# EasyEDA Pro project ProProject_7SegmentDisplay_2024-07-23.epro

# Schematic Breakout
Create Date: 2024-07-23; Page Name: P1; Project Name: 7SegmentDisplay; Schematic Name: Breakout; Update Date: 2024-07-23; Company: EasyEDA.com; Drawn: EasyEDA; Page Size: A4; Part Number: JLCPCB-002; Reviewed: EasyEDA; Version: V0.1
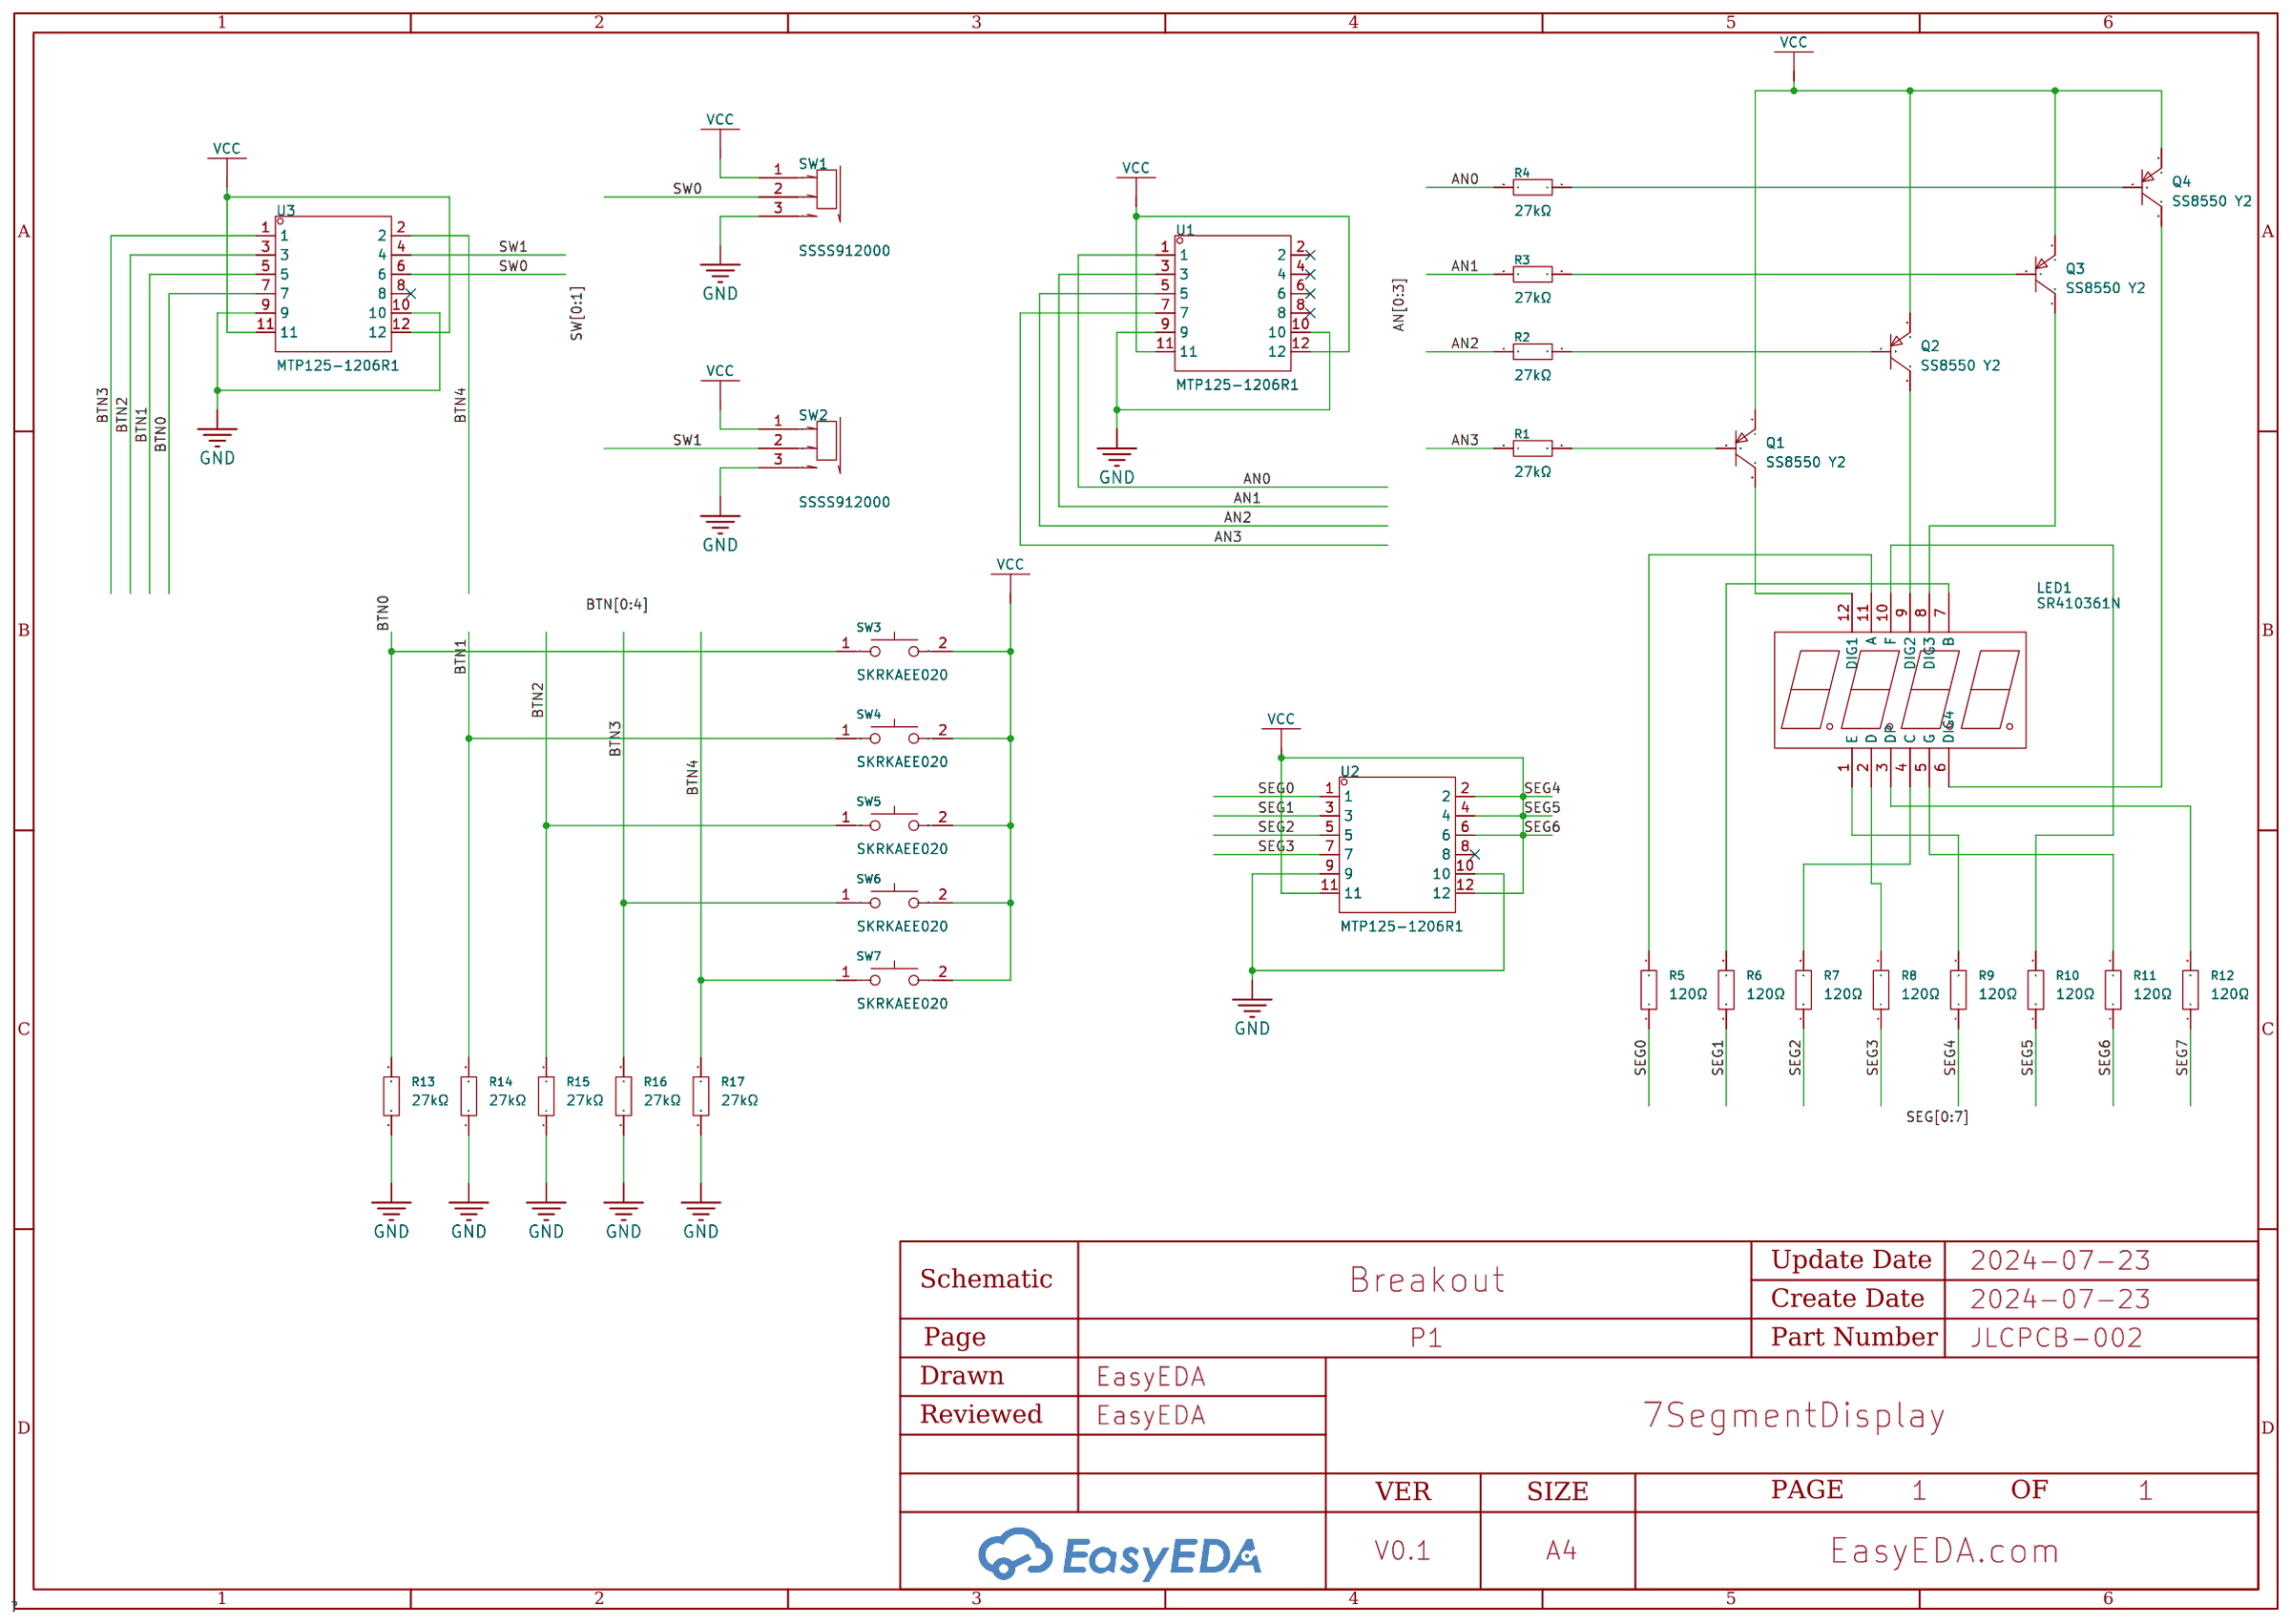
[diagram p0: schematic sheet]

## Parts
LED1  SR410361N  [LED-SEG-TH_12P-L30.0-W14.0-P2.54-S10.26-BL]
Q1  SS8550 Y2  [SOT-23-3_L2.9-W1.3-P1.90-LS2.4-BR]
Q2  SS8550 Y2  [SOT-23-3_L2.9-W1.3-P1.90-LS2.4-BR]
Q3  SS8550 Y2  [SOT-23-3_L2.9-W1.3-P1.90-LS2.4-BR]
Q4  SS8550 Y2  [SOT-23-3_L2.9-W1.3-P1.90-LS2.4-BR]
R1  27kΩ  [R0603]
R2  27kΩ  [R0603]
R3  27kΩ  [R0603]
R4  27kΩ  [R0603]
R5  120Ω  [R0603]
R6  120Ω  [R0603]
R7  120Ω  [R0603]
R8  120Ω  [R0603]
R9  120Ω  [R0603]
R10  120Ω  [R0603]
R11  120Ω  [R0603]
R12  120Ω  [R0603]
R13  27kΩ  [R0603]
R14  27kΩ  [R0603]
R15  27kΩ  [R0603]
R16  27kΩ  [R0603]
R17  27kΩ  [R0603]
SW1  SSSS912000  [SW-TH_SSSS912000]
SW2  SSSS912000  [SW-TH_SSSS912000]
SW3  SKRKAEE020  [SW-SMD_L3.9-W3.0-P4.45]
SW4  SKRKAEE020  [SW-SMD_L3.9-W3.0-P4.45]
SW5  SKRKAEE020  [SW-SMD_L3.9-W3.0-P4.45]
SW6  SKRKAEE020  [SW-SMD_L3.9-W3.0-P4.45]
SW7  SKRKAEE020  [SW-SMD_L3.9-W3.0-P4.45]
U1  MTP125-1206R1  [HDR-TH_12P-P2.54-H-M-R2-C6-S2.54-W10.0]
U2  MTP125-1206R1  [HDR-TH_12P-P2.54-H-M-R2-C6-S2.54-W10.0]
U3  MTP125-1206R1  [HDR-TH_12P-P2.54-H-M-R2-C6-S2.54-W10.0]

## Library data of the parts
LED1 = SR410361N: Number of Characters:4Bit Luminous Color:Red LED Polarity:共阳极 Digit/Alpha Size(inch):0.36; LCSC Part Name: 4位0.36英寸红色数码管 共阳极; Supplier Part: C132660; Manufacturer: ARKLED(方舟); Supplier Footprint: 插件; JLCPCB Part Class: Extended Part; Datasheet: https://atta.szlcsc.com/upload/public/pdf/source/20171014/C132660_15079754140001038126.pdf; Supplier: LCSC; Number of Characters: 4Bit; Luminous Color: Red; LED Polarity: 共阳极; Digit/Alpha Size(inch): 0.36
Q1-Q4 = SS8550 Y2: Transistor Type: Collector Current (Ic): Collector-Emitter Breakdown Voltage (Vceo): Power Dissipation (Pd): DC Current Gain (hFE@Ic,Vce):200@100mA,1V DC Current Gain (hFE@Ic,Vce):200@100mA,1V Transition Frequency (fT):100MHz Collector Cut-Off Current (Ic; LCSC Part Name: SS8550 Y2(RANGE:200-350) hfe=200~350; Supplier Part: C8542; Manufacturer: CJ(江苏长电/长晶); Supplier Footprint: SOT-23; JLCPCB Part Class: Basic Part; Datasheet: https://atta.szlcsc.com/upload/public/pdf/source/20140809/1457707214734.pdf; Supplier: LCSC; DC Current Gain (hFE@Ic,Vce): 200@100mA,1V; Transition Frequency (fT): 100MHz; Collector Cut-Off Current (Icbo): 100nA; Collector-Emitter Saturation Voltage (VCE(sat)@Ic,Ib): 500mV@800mA,80mA
R1-R4 R13-R17 = 0603WAF2702T5E: Type:Thick Film Resistors Resistance:27kΩ Tolerance:±1% Tolerance:±1% Power(Watts): Overload Voltage (Max): Temperature Coefficient:±100ppm/℃ Temperature Coefficient:±100ppm/℃ Operating Temperature Range:-55℃~+155℃ Operating Temperature Range:-55℃~+155℃; LCSC Part Name: 27kΩ ±1% 100mW 厚膜电阻; Supplier Part: C22967; Manufacturer: UNI-ROYAL(厚声); Supplier Footprint: 0603; JLCPCB Part Class: Basic Part; Datasheet: https://atta.szlcsc.com/upload/public/pdf/source/20200306/C422600_1E6D84923E4A46A82E41ADD87F860B5C.pdf; Supplier: LCSC; Type: Thick Film Resistors; Tolerance: ±1%; Temperature Coefficient: ±100ppm/℃; Operating Temperature Range: -55℃~+155℃
R5-R12 = 0603WAF1200T5E: Type:Thick Film Resistors Resistance: Tolerance:±1% Tolerance:±1% Power(Watts): Overload Voltage (Max): Temperature Coefficient:±100ppm/℃ Temperature Coefficient:±100ppm/℃ Operating Temperature Range:-55℃~+155℃ Operating Temperature Range:-55℃~+155℃; LCSC Part Name: 120Ω ±1% 100mW 厚膜电阻; Supplier Part: C22787; Manufacturer: UNI-ROYAL(厚声); Supplier Footprint: 0603; JLCPCB Part Class: Basic Part; Datasheet: https://atta.szlcsc.com/upload/public/pdf/source/20200306/C422600_1E6D84923E4A46A82E41ADD87F860B5C.pdf; Supplier: LCSC; Type: Thick Film Resistors; Tolerance: ±1%; Temperature Coefficient: ±100ppm/℃; Operating Temperature Range: -55℃~+155℃
SW1 SW2 = SSSS912000: Circuit:SPDT Actuator Style:Rectangular columnar Pin Style:PCPin Switch Height:7.5mm Mounting Style:Straight Current Rating (DC):100mA Voltage Rating (DC):12V Current Rating (AC):- Voltage Rating (AC):- Mechanical Life:1万次 Operating Temperature:-40℃~+85℃; LCSC Part Name: 11.5*4.7*5.5 立式、侧滑、插件; Supplier Part: C125042; Manufacturer: ALPSALPINE(阿尔卑斯阿尔派); Supplier Footprint: 插件; JLCPCB Part Class: Extended Part; Datasheet: https://atta.szlcsc.com/upload/public/pdf/source/20170810/C125042_1502335341300879902.pdf; Supplier: LCSC; Circuit: SPDT; Actuator Style: Rectangular columnar; Pin Style: PCPin; Switch Height: 7.5mm; Mounting Style: Straight; Current Rating (DC): 100mA; Voltage Rating (DC): 12V; Mechanical Life: 1万次; Operating Temperature: -40℃~+85℃
SW3-SW7 = SKRKAEE020: Circuit:SPST Actuator Style:Round Button Mounting Style:Brick nogging Switch Length:3.9mm Switch Width:2.9mm Switch Height:2mm Contact Current:50mA Voltage Rating (DC):12V With Lamp:- Mechanical Life:-; LCSC Part Name: 3.9*2.9*2mm 立贴 轻触开关; Supplier Part: C115357; Manufacturer: ALPSALPINE(阿尔卑斯阿尔派); Supplier Footprint: SMD; JLCPCB Part Class: Extended Part; Datasheet: https://atta.szlcsc.com/upload/public/pdf/source/20170620/1497944814772.pdf; Supplier: LCSC; Circuit: SPST; Actuator Style: Round Button; Mounting Style: Brick nogging; Switch Length: 3.9mm; Switch Width: 2.9mm; Switch Height: 2mm; Contact Current: 50mA; Voltage Rating (DC): 12V
U1-U3 = MTP125-1206R1: Pin Structure:2x6P Pitch:2.54mm Row Spacing:2.54mm Circluar Pins/Square Pins:Square Pins Mounting Type:Right-Angle Number of Rows:双排 Number of Pins:12P Current Rating (Max):- Voltage Rating (Max):- Length of Mating Pin:6mm Insulation Height:2.5mm Contact; LCSC Part Name: 间距:2.54mm 2x6P 弯插 方针; Supplier Part: C358708; Manufacturer: MINTRON(明硕); Supplier Footprint: 弯插,P=2.54mm; JLCPCB Part Class: Extended Part; Datasheet: https://atta.szlcsc.com/upload/public/pdf/source/20190124/C358715_0B07059077498948F6775535AEFCD469.pdf; Supplier: LCSC; Pin Structure: 2x6P; Pitch: 2.54mm; Row Spacing: 2.54mm; Circluar Pins/Square Pins: Square Pins; Mounting Type: Right-Angle; Number of Rows: 双排; Number of Pins: 12P; Length of Mating Pin: 6mm; Insulation Height: 2.5mm; Operating Temperature Range: -40℃~+105℃; Color: Black

## Nets
GND: R13.1 R14.1 R15.1 R16.1 R17.1 SW1.3 SW2.3 U1.9 U1.10 U2.9 U2.10 U3.9 U3.10
VCC: Q1.2(E) Q2.2(E) Q3.2(E) Q4.2(E) SW1.1 SW2.1 SW3.2 SW4.2 SW5.2 SW6.2 SW7.2 U1.11 U1.12 U2.11 U2.12 U3.11 U3.12
AN0: R4.1 U1.1
AN1: R3.1 U1.3
AN2: R2.1 U1.5
AN3: R1.1 U1.7
BTN0: R13.2 SW3.1 U3.7
BTN1: R14.2 SW4.1 U3.5
BTN2: R15.2 SW5.1 U3.3
BTN3: R16.2 SW6.1 U3.1
BTN4: R17.2 SW7.1 U3.2
SEG0: R5.1 U2.1
SEG1: R6.1 U2.3
SEG2: R7.1 U2.5
SEG3: R8.1 U2.7
SEG4: R9.1 U2.2
SEG5: R10.1 U2.4
SEG6: R11.1 U2.6
SEG7: R12.1
SW0: SW1.2 U3.6
SW1: SW2.2 U3.4
$1N375: LED1.12(DIG1) Q1.3(C)
$1N379: LED1.9(DIG2) Q2.3(C)
$1N382: LED1.8(DIG3) Q3.3(C)
$1N387: LED1.6(DIG4) Q4.3(C)
$1N607: Q4.1(B) R4.2
$1N610: Q3.1(B) R3.2
$1N620: Q2.1(B) R2.2
$1N623: Q1.1(B) R1.2
$1N1034: LED1.11(A) R5.2
$1N1039: LED1.7(B) R6.2
$1N1044: LED1.4(C) R7.2
$1N1049: LED1.2(D) R8.2
$1N1054: LED1.1(E) R9.2
$1N1059: LED1.10(F) R10.2
$1N1066: LED1.5(G) R11.2
$1N1076: LED1.3(DP) R12.2

Not connected (* = marked no-connect by the designer): U1 2* 4* 6* 8*; U2 8*; U3 8*

# Board PCB5
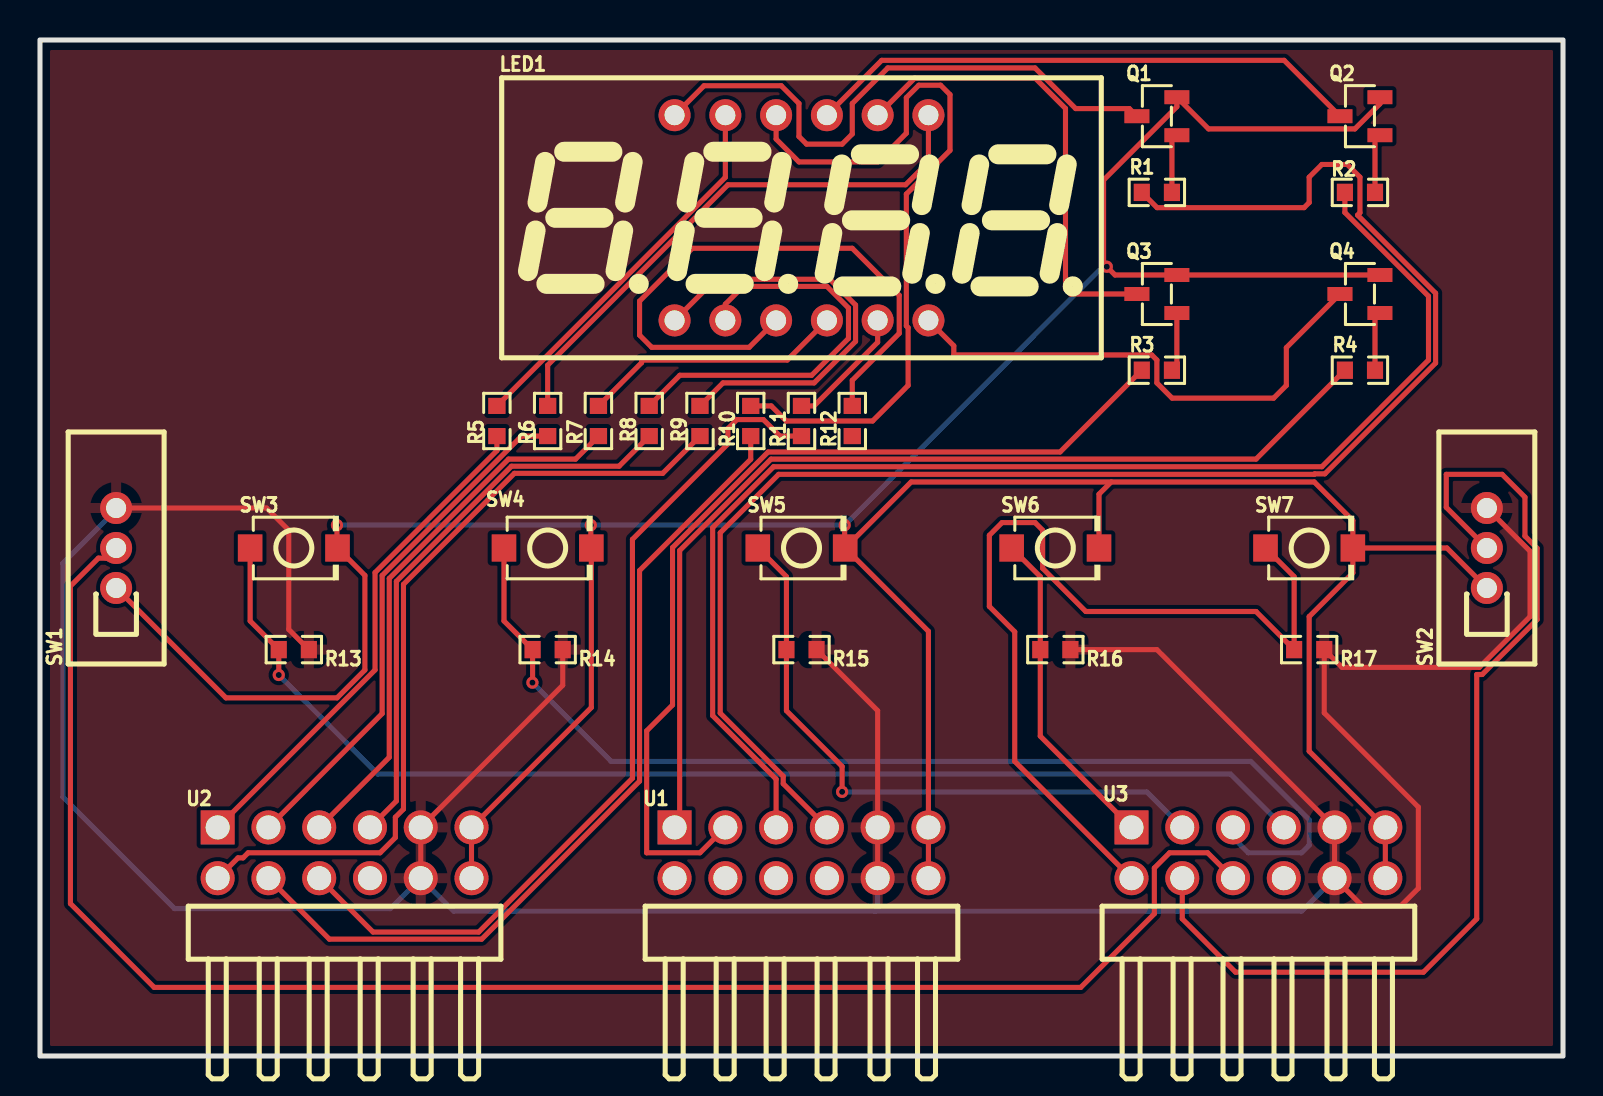
[diagram p1: board, top side]
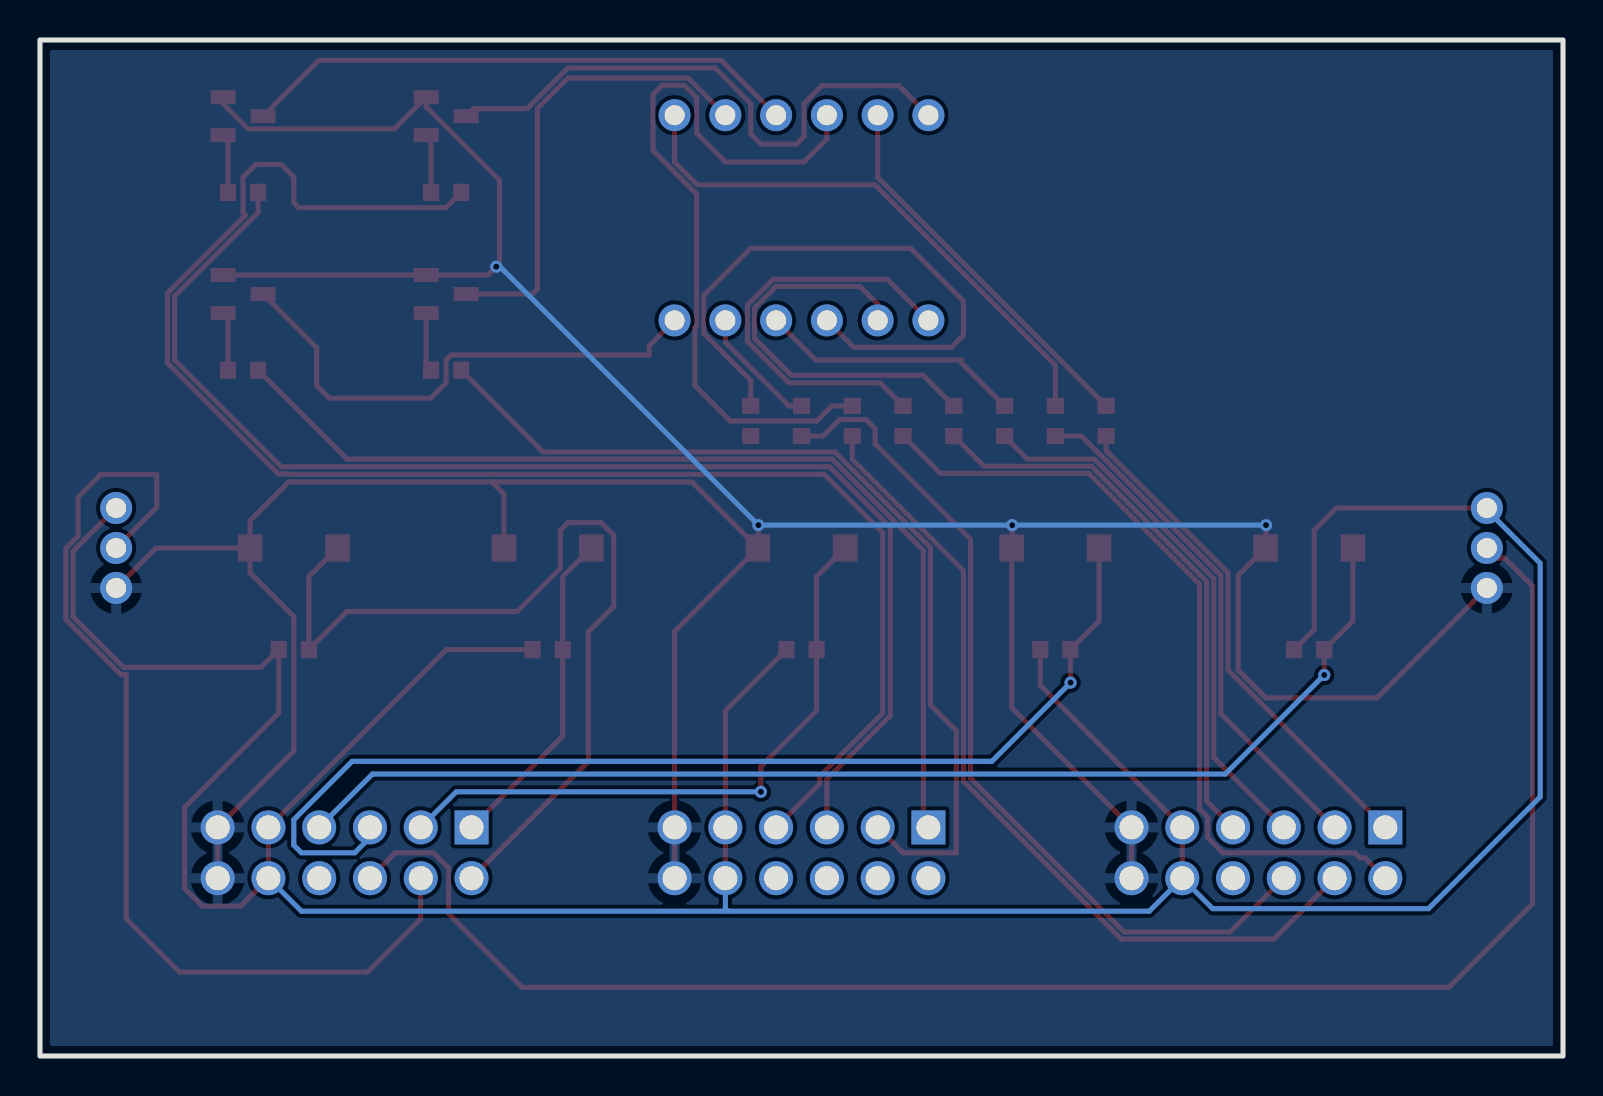
[diagram p2: board, bottom side, seen from below]

Outline 76.2 x 50.8 mm; copper layers: Top Layer, Bottom Layer. Coordinates in mm from the lower left corner of the outline.
Outline path: rectangle 0,50.8 76.2,0
Stack: Top Layer 0.035mm - / Dielectric1 0.91mm FR4 er 4.5 / Bottom Layer 0.035mm -

## Design rules (mm)
template: JLCPCB Capability(Two Layers Board)
spacing copperThickness1oz (default): track to track 0.102, other pairs 0.152 to 0.3
spacing copperThickness2oz: track to track 0.203, other pairs 0.152 to 0.3
track width copperThickness1oz (default): min 0.127, default 0.254, max 2.54
track width copperThickness2oz: min 0.203, default 0.254, max 2.54
differential pair differentialPair (default): width min 0.127, default 0.254, max 2.54; gap min 0.152, default 0.152
via viaSize (default): diameter min 0.5, default 0.61, max 10; hole min 0.3, default 0.305, max 6.3

## Placement (name value [footprint] x y rotation side)
LED1  SR410361N  [LED-SEG-TH_12P-L30.0-W14.0-P2.54-S10.26-BL]  38.1 41.91 0 top
Q1  SS8550 Y2  [SOT-23-3_L2.9-W1.3-P1.90-LS2.4-BR]  55.88 46.99 0 top
Q2  SS8550 Y2  [SOT-23-3_L2.9-W1.3-P1.90-LS2.4-BR]  66.04 46.99 0 top
Q3  SS8550 Y2  [SOT-23-3_L2.9-W1.3-P1.90-LS2.4-BR]  55.88 38.1 0 top
Q4  SS8550 Y2  [SOT-23-3_L2.9-W1.3-P1.90-LS2.4-BR]  66.04 38.1 0 top
R1  27kΩ  [R0603]  55.88 43.18 0 top
R2  27kΩ  [R0603]  66.04 43.18 0 top
R3  27kΩ  [R0603]  55.88 34.29 0 top
R4  27kΩ  [R0603]  66.04 34.29 0 top
R5  120Ω  [R0603]  22.86 31.75 90 top
R6  120Ω  [R0603]  25.4 31.75 90 top
R7  120Ω  [R0603]  27.94 31.75 90 top
R8  120Ω  [R0603]  30.48 31.75 90 top
R9  120Ω  [R0603]  33.02 31.75 90 top
R10  120Ω  [R0603]  35.56 31.75 90 top
R11  120Ω  [R0603]  38.1 31.75 90 top
R12  120Ω  [R0603]  40.64 31.75 90 top
R13  27kΩ  [R0603]  12.7 20.32 180 top
R14  27kΩ  [R0603]  25.4 20.32 180 top
R15  27kΩ  [R0603]  38.1 20.32 180 top
R16  27kΩ  [R0603]  50.8 20.32 180 top
R17  27kΩ  [R0603]  63.5 20.32 180 top
SW1  SSSS912000  [SW-TH_SSSS912000]  3.81 25.4 90 top
SW2  SSSS912000  [SW-TH_SSSS912000]  72.39 25.4 90 top
SW3  SKRKAEE020  [SW-SMD_L3.9-W3.0-P4.45]  12.7 25.4 0 top
SW4  SKRKAEE020  [SW-SMD_L3.9-W3.0-P4.45]  25.4 25.4 0 top
SW5  SKRKAEE020  [SW-SMD_L3.9-W3.0-P4.45]  38.1 25.4 0 top
SW6  SKRKAEE020  [SW-SMD_L3.9-W3.0-P4.45]  50.8 25.4 0 top
SW7  SKRKAEE020  [SW-SMD_L3.9-W3.0-P4.45]  63.5 25.4 0 top
U1  MTP125-1206R1  [HDR-TH_12P-P2.54-H-M-R2-C6-S2.54-W10.0]  38.1 10.16 0 top
U2  MTP125-1206R1  [HDR-TH_12P-P2.54-H-M-R2-C6-S2.54-W10.0]  15.24 10.16 0 top
U3  MTP125-1206R1  [HDR-TH_12P-P2.54-H-M-R2-C6-S2.54-W10.0]  60.96 10.16 0 top

## Footprints (pads in the part's own frame, mm; a bottom-side part is the same pattern mirrored in y, then rotated)
HDR-TH_12P-P2.54-H-M-R2-C6-S2.54-W10.0
  rect 1.7x1.7 hole 1.2: 1(-6.35,1.27)
  round 1.7 hole 1.2: 2(-6.35,-1.27) 3(-3.81,1.27) 4(-3.81,-1.27) 5(-1.27,1.27) 6(-1.27,-1.27) 7(1.27,1.27) 8(1.27,-1.27) 9(3.81,1.27) 10(3.81,-1.27) 11(6.35,1.27) 12(6.35,-1.27)
LED-SEG-TH_12P-L30.0-W14.0-P2.54-S10.26-BL
  round 1.6 hole 1: 1(-6.35,-5.13) 2(-3.81,-5.13) 3(-1.27,-5.13) 4(1.27,-5.13) 5(3.81,-5.13) 6(6.35,-5.13) 7(6.35,5.13) 8(3.81,5.13) 9(1.27,5.13) 10(-1.27,5.13) 11(-3.81,5.13) 12(-6.35,5.13)
R0603
  rect 0.806x0.864 smd: 1(-0.753,0) 2(0.753,0)
SOT-23-3_L2.9-W1.3-P1.90-LS2.4-BR
  rect 1.25x0.7 smd: 1(1,-0.95) 2(1,0.95) 3(-1,0)
SW-SMD_L3.9-W3.0-P4.45
  rect 1.23x1.36 smd: 1(-2.185,0) 2(2.185,0)
SW-TH_SSSS912000
  round 1.6 hole 1: 1(-1.999,0) 2(0,0) 3(1.999,0)

## Nets
As in the schematic.

Pads without a net: U1 2 4 6 8; U2 8; U3 8

## Via types
v1: diameter 0.61, hole 0.305, Top Layer to Bottom Layer, 7 vias

## Routing (per net, layer and track width the routed paths; a pad name or vN(x,y) marks a point on that pad's centre or on a via; arc(x,y) is an arc through that point)
GND: length 184.2
  Top Layer w0.254: U2.10 U2.9 26.15,18.53 R14.1 ; SW1.3 11.34,27.4 12.45,26.29 12.45,21.33 R13.1 ; SW2.3 74.55,25.24 74.55,21.97 72.01,19.43 65.14,19.43 R17.1 64.25,17.15 68.96,12.45 68.96,8.38 68.07,7.49 66.17,7.49 U3.10 U3.9 55.88,20.32 R16.1 ; U1.10 U1.9 41.91,17.26 R15.1
  Bottom Layer w0.254: 41.78,7.24 63.12,7.24 U3.10 ; 41.78,7.24 20.7,7.24 U2.10 17.53,7.37 6.73,7.37 1.14,12.95 1.14,24.64 3.81,27.31 SW1.3 ; 41.78,7.24 41.91,7.37 U1.10
VCC: length 201.1
  Top Layer w0.254: 53.59,28.7 63.75,28.7 65.69,26.77 SW7.2 ; 53.59,28.7 52.99,28.09 SW6.2 ; 53.59,28.7 43.59,28.7 SW5.2 ; SW7.2 65.69,24.16 63.5,21.97 63.5,15.24 U3.11 U3.12 ; SW7.2 70.39,25.4 72.39,23.4 ; v1(27.56,26.54) 27.56,25.43 SW4.2 27.59,17.42 U2.11 U2.12 ; 3.81,23.4 9.3,17.91 14.86,17.91 16.26,19.3 16.26,24.03 SW3.2 14.86,25.43 v1(14.86,26.54) ; Q4.2 Q3.2 53.79,39.05 53.21,39.62 53.21,43.8 56.88,47.46 Q1.2 58.47,46.36 65.79,46.36 67.04,47.61 Q2.2 ; v1(40.26,26.54) 40.26,25.43 SW5.2 ; SW5.2 44.45,21.23 U1.11 U1.12
  Bottom Layer w0.254: v1(53.37,39.46) 53.18,39.46 v1(40.26,26.54) v1(27.56,26.54) v1(14.86,26.54)
AN0: length 51
  Top Layer w0.254: R4.1 60.84,29.84 36.58,29.84 32,25.27 32,11.68 U1.1
AN1: length 47.4
  Top Layer w0.254: R3.1 51.04,30.2 36.43,30.2 31.65,25.42 31.65,17.55 30.35,16.26 30.35,10.16 33.02,10.16 U1.3
AN2: length 65.7
  Top Layer w0.254: U1.5 36.83,13.84 33.66,17.02 33.66,26.42 36.7,29.46 64.13,29.46 69.47,34.8 69.47,37.99 65.29,42.17 R2.1
AN3: length 80.3
  Top Layer w0.254: U1.7 37.19,13.61 37.19,13.99 34.03,17.14 34.03,26.16 36.96,29.08 63.75,29.08 63.78,29.11 64.28,29.11 69.82,34.65 69.82,38.14 65.92,42.04 66.04,42.16 66.04,43.94 65.41,44.58 64.13,44.58 63.5,43.94 63.5,42.67 63.25,42.42 55.89,42.42 R1.1
BTN0: length 60.4
  Top Layer w0.254: v1(11.95,19.05) R13.2 10.52,21.75 SW3.1
  Bottom Layer w0.254: v1(11.95,19.05) 16.9,14.1 59.56,14.1 U3.7
BTN1: length 55.1
  Top Layer w0.254: SW4.1 23.22,21.75 R14.2 24.65,18.68 v1(24.64,18.67)
  Bottom Layer w0.254: v1(24.64,18.67) 28.57,14.73 60.58,14.73 63.5,11.81 63.5,10.54 63.12,10.16 60.45,10.16 59.69,10.92 U3.5
BTN2: length 31.7
  Top Layer w0.254: v1(40.13,13.21) 40.13,14.48 37.35,17.26 R15.2 37.35,23.97 SW5.1
  Bottom Layer w0.254: v1(40.13,13.21) 55.37,13.21 U3.3
BTN3: length 16.5
  Top Layer w0.254: U3.1 50.05,15.99 R16.2 50.05,23.97 SW6.1
BTN4: length 45
  Top Layer w0.254: SW7.1 62.75,23.97 R17.2 60.84,22.22 52.32,22.22 50.16,24.38 50.16,26.29 49.78,26.67 48.13,26.67 47.5,26.03 47.5,22.48 48.77,21.21 48.77,14.73 U3.2
SEG0: length 25.4
  Top Layer w0.254: R5.1 22.86,30.27 16.76,24.17 16.76,19.3 U2.1
SEG1: length 26.1
  Top Layer w0.254: R6.1 24.09,31 17.12,24.03 17.12,17.12 U2.3
SEG2: length 27.3
  Top Layer w0.254: U2.5 17.47,14.94 17.47,23.88 23.44,29.84 26.8,29.84 27.94,30.99 R7.1
SEG3: length 28.5
  Top Layer w0.254: R8.1 28.97,29.49 23.59,29.49 17.83,23.73 17.83,12.75 U2.7
SEG4: length 40.5
  Top Layer w0.254: U2.2 9.91,9.91 10.16,9.91 10.41,10.16 17.02,10.16 17.78,10.92 17.78,11.94 18.19,12.34 18.19,23.58 23.74,29.13 31.16,29.13 R9.1
SEG5: length 42.7
  Top Layer w0.254: R10.1 35.56,29.84 30,24.27 30,13.74 22.1,5.84 14.48,5.84 U2.4
SEG6: length 43.6
  Top Layer w0.254: U2.6 16.66,6.2 21.95,6.2 29.64,13.89 29.64,25.83 34.42,30.61 34.42,31.37 34.87,31.82 36.19,31.82 37.01,31 R11.1
SW0: length 83.5
  Top Layer w0.254: U3.6 58.42,10.16 56.51,10.16 55.75,9.4 55.75,7.11 52.07,3.43 5.72,3.43 1.52,7.62 1.52,23.5 2.92,24.89 3.3,24.89 SW1.2
SW1: length 50.7
  Top Layer w0.254: U3.4 57.15,6.86 59.82,4.19 69.22,4.19 71.88,6.86 71.88,19.08 72.16,19.08 74.91,21.82 74.91,25.39 74.29,26 74.29,27.94 73.15,29.08 70.36,29.08 70.36,27.43 SW2.2
$1N375: length 29.4
  Top Layer w0.254: LED1.12 33.22,48.51 37.08,48.51 37.97,47.62 37.97,45.97 38.35,45.59 40.13,45.59 40.64,46.1 40.64,47.62 42.42,49.4 49.78,49.4 51.82,47.37 54.5,47.37 Q1.3
$1N379: length 28
  Top Layer w0.254: LED1.9 42.11,49.78 62.25,49.78 Q2.3
$1N382: length 23.5
  Top Layer w0.254: Q3.3 51.56,38.1 51.31,38.35 51.31,47.38 49.79,48.89 43.76,48.89 LED1.8
$1N387: length 26.4
  Top Layer w0.254: LED1.6 45.72,35.51 45.72,35.05 55.63,35.05 55.88,34.8 55.88,33.66 56.64,32.89 61.72,32.89 62.36,33.53 62.36,35.42 Q4.3
$1N607: length 3
  Top Layer w0.254: Q4.1 66.79,36.9 R4.2
$1N610: length 3
  Top Layer w0.254: Q3.1 56.88,34.54 R3.2
$1N620: length 3
  Top Layer w0.254: R2.2 66.79,45.79 Q2.1
$1N623: length 3
  Top Layer w0.254: R1.2 56.63,45.79 Q1.1
$1N1034: length 19.3
  Top Layer w0.254: R5.2 34.29,43.93 LED1.11
$1N1039: length 27.6
  Top Layer w0.254: LED1.7 44.45,44.7 43.31,43.56 34.42,43.56 25.4,34.54 R6.2
$1N1044: length 13.3
  Top Layer w0.254: R7.2 30.1,34.66 30.1,34.8 37.39,34.8 LED1.4
$1N1049: length 20.7
  Top Layer w0.254: R8.2 32.01,34.04 38.61,34.04 40.45,35.88 40.45,37.4 39.37,38.48 35.18,38.48 34.29,37.59 LED1.2
$1N1054: length 21.4
  Top Layer w0.254: R9.2 34.17,33.66 38.73,33.66 40.81,35.73 40.81,37.55 39.52,38.84 33.81,38.84 LED1.1
$1N1059: length 37.6
  Top Layer w0.254: R10.2 36.58,32.5 37.34,31.75 41.66,31.75 43.43,33.53 43.43,36.42 43.35,36.5 43.35,43.1 45.53,45.28 45.53,48.07 45.06,48.54 43.97,48.54 43.35,47.92 43.35,46.14 41.91,44.7 37.97,44.7 36.83,45.85 LED1.10
$1N1066: length 6.2
  Top Layer w0.254: R11.2 38.73,32.5 41.91,35.69 LED1.5
$1N1076: length 30.9
  Top Layer w0.254: LED1.3 35.48,35.43 30.61,35.43 30,36.04 30,37.75 32.64,40.39 40.64,40.39 42.99,38.04 42.99,36.13 40.64,33.78 R12.2

## Copper pours and planes (outline as drawn; the poured copper is in the pictures)
GND on Top Layer: 0,50.8 76.2,50.8 76.2,0 0,0
VCC on Bottom Layer: 0,50.8 76.2,50.8 76.2,0 0,0
